# Altium schematic sheet РЕУН.468332.001_MCU.SchDoc: Плата
size 594 x 420 mm; ApprovedBy: Шавликов; CheckedBy: Шавликов; DrawnBy: Подлесный; SheetNumber: 1; SheetTotal: 6; Вид изделия: Документация; Раздел: Документация; Код документа: Э3; Вид документа: Схема электрическая принципиальная; Класс документа: Конструкторский документ; Создавать изделие в PLM: Yes; DocumentCode: РЕУН.468332.001 Э3 2D; DocumentView: Схема электрическая принципиальная; DocumentClass: Конструкторский документ; ProductView: Документация; DocName: Плата; Title_2: термостабилизации; Format: A2; DocumentType: Схема электрическая принципиальная; ImagePath: РЕУН.468332.001 Э3 ТЭ
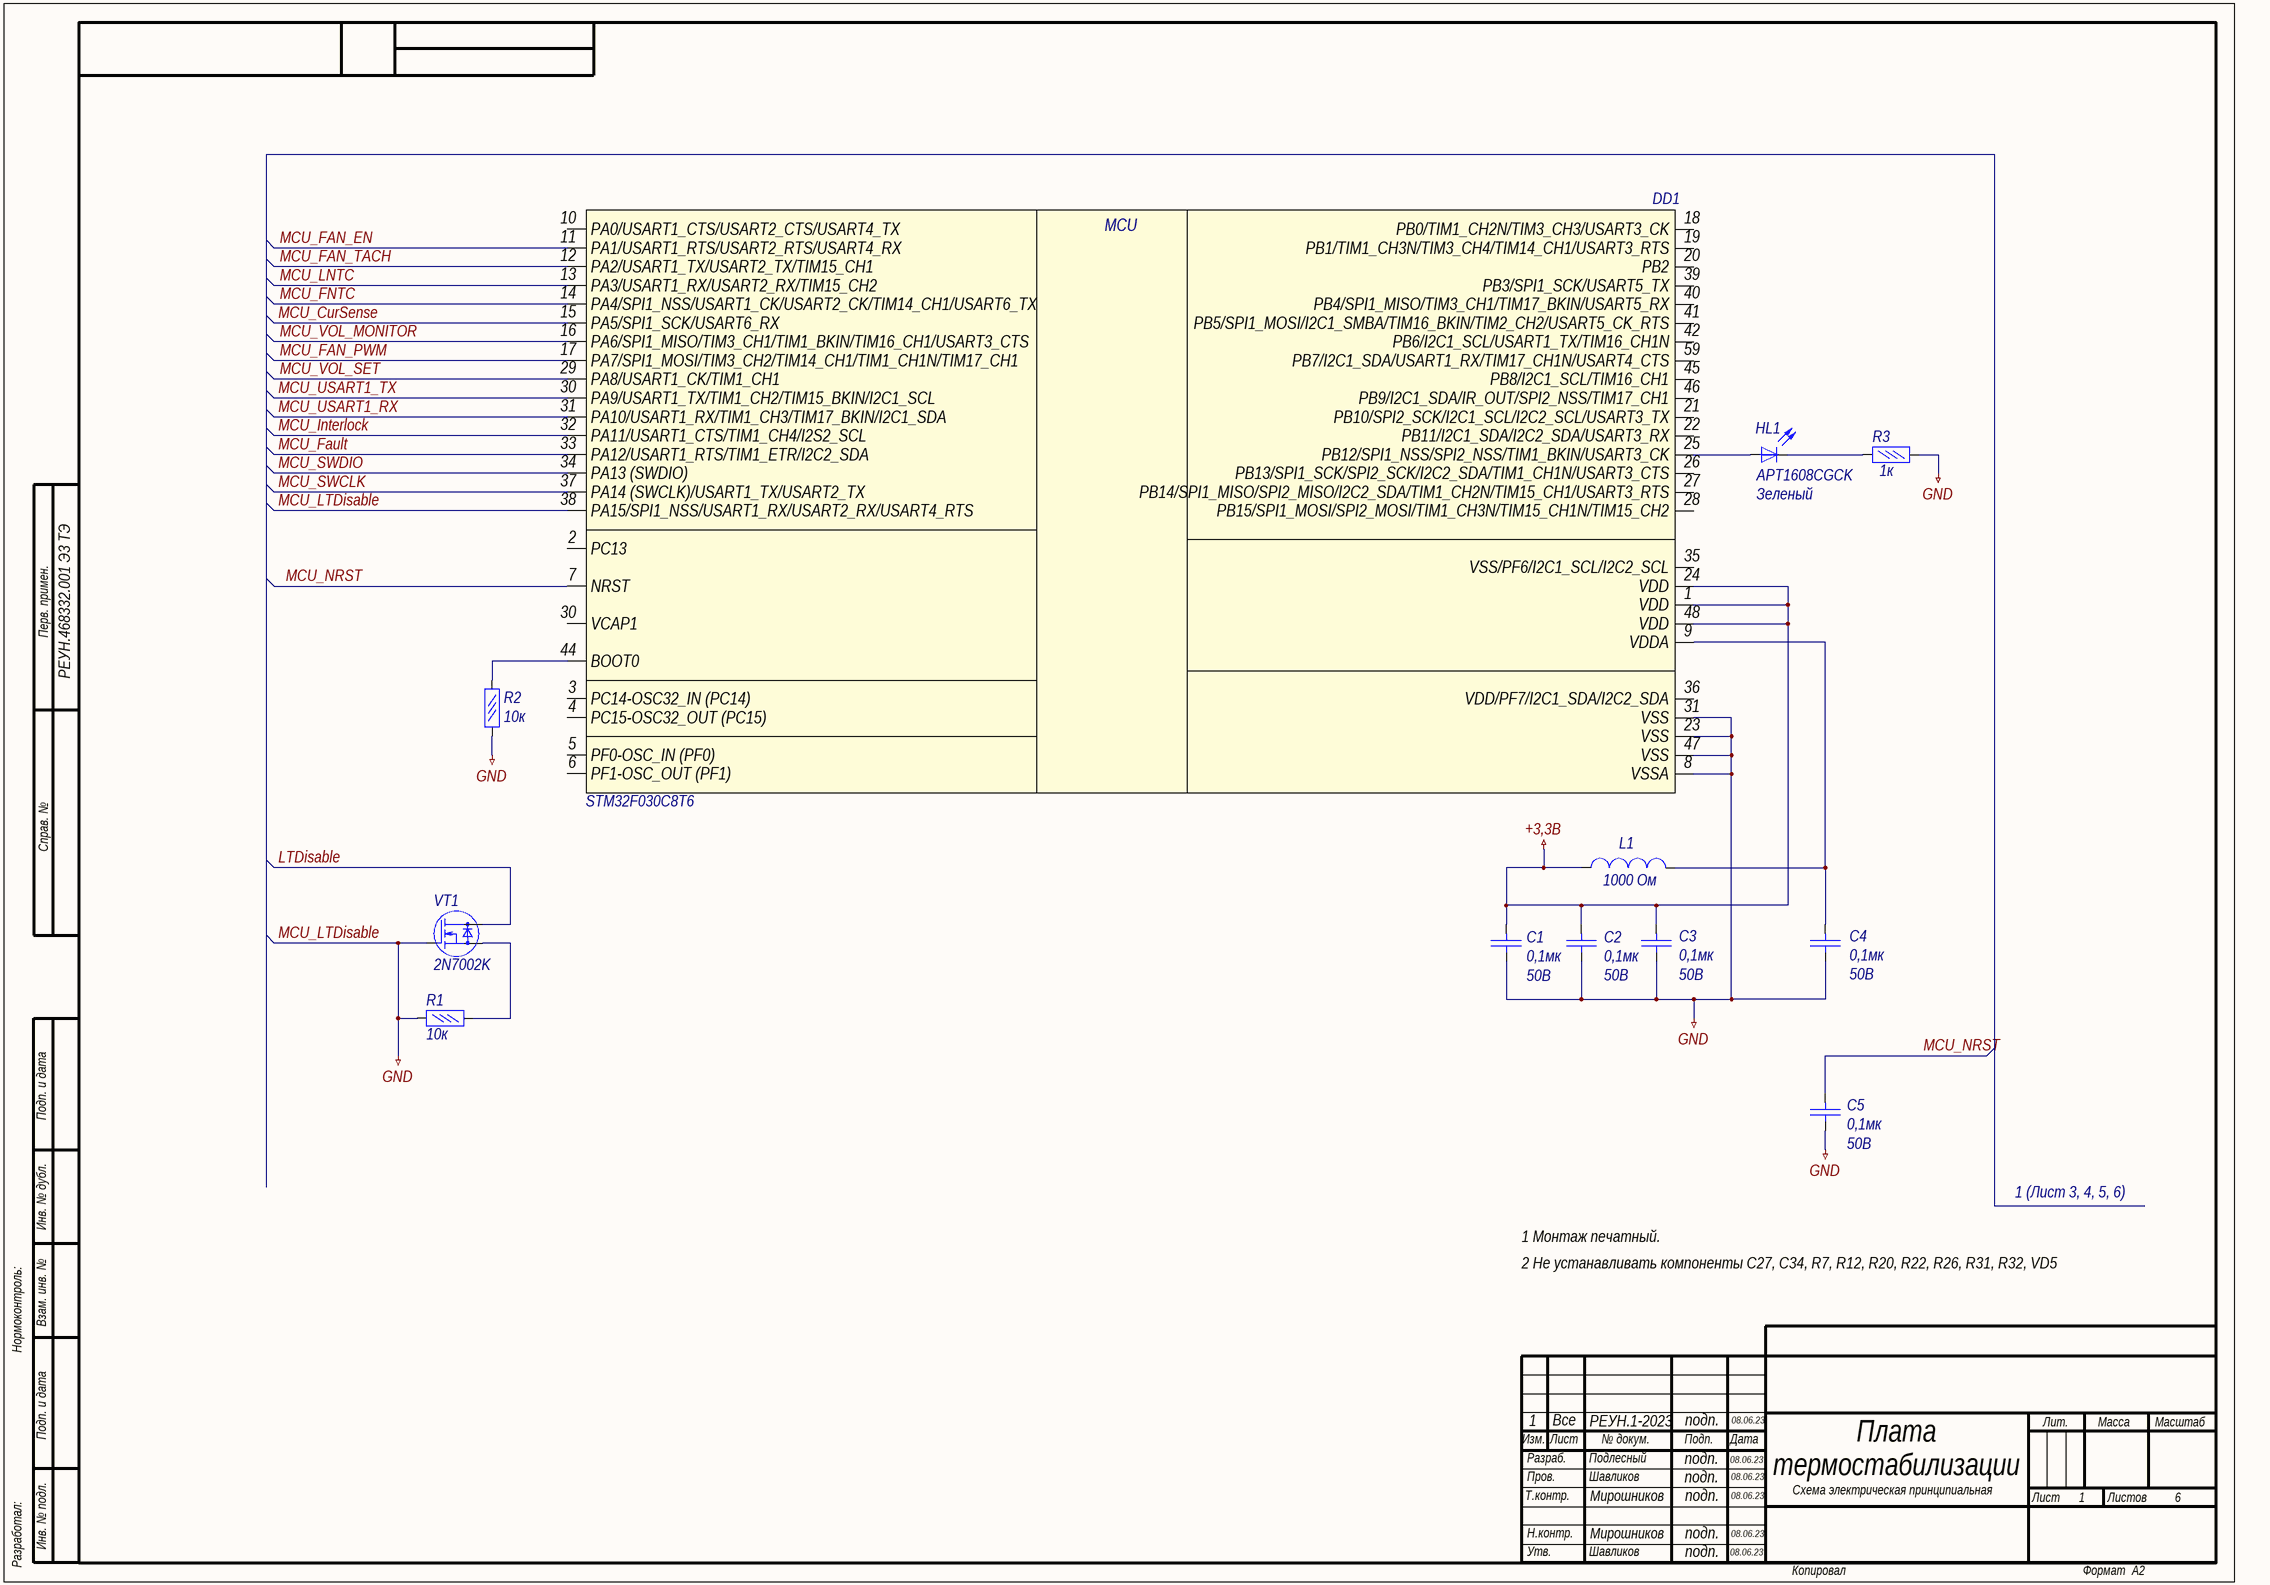
[diagram p0: РЕУН.468332.001_MCU.SchDoc]

## Parts
C1  Voltage: 50В  [C0805_AA]  (hidden comment: 0,1мк)
C2  Voltage: 50В  [C0805_AA]  (hidden comment: 0,1мк)
C3  Voltage: 50В  [C0805_AA]  (hidden comment: 0,1мк)
C4  Voltage: 50В  [C0805_AA]  (hidden comment: 0,1мк)
C5  Voltage: 50В  [C0805_AA]  (hidden comment: 0,1мк)
DD1  STM32F030C8T6
HL1  Color: Зеленый  (hidden comment: APT1608CGCK)
L1  1000 Ом  [L0603_A]
R1  10к  [R1206]
R2  10к  [R1206]
R3  1к  [R1206]
VT1  2N7002K  [SOT23-3]

## Nets
+3,3В: C1.2 C2.2 C3.2 DD1.1(VDD) DD1.24(VDD) DD1.48(VDD) L1.1
MCU_LTDisable: C1.1 C2.1 C3.1 C4.1 C5.1 DD1.8(VSSA) DD1.23(VSS) DD1.31(VSS) DD1.38(PA15/SPI1_NSS/USART1_RX/USART2_RX/USART4_RTS) DD1.47(VSS) R1.2 R2.1 R3.1 VT1.1(G)  [also labelled GND]
LTDisable: VT1.3(D)
MCU_CurSense: DD1.15(PA5/SPI1_SCK/USART6_RX)
MCU_FAN_EN: DD1.11(PA1/USART1_RTS/USART2_RTS/USART4_RX)
MCU_FAN_PWM: DD1.17(PA7/SPI1_MOSI/TIM3_CH2/TIM14_CH1/TIM1_CH1N/TIM17_CH1)
MCU_FAN_TACH: DD1.12(PA2/USART1_TX/USART2_TX/TIM15_CH1)
MCU_Fault: DD1.33(PA12/USART1_RTS/TIM1_ETR/I2C2_SDA)
MCU_FNTC: DD1.14(PA4/SPI1_NSS/USART1_CK/USART2_CK/TIM14_CH1/USART6_TX)
MCU_Interlock: DD1.32(PA11/USART1_CTS/TIM1_CH4/I2S2_SCL)
MCU_LNTC: DD1.13(PA3/USART1_RX/USART2_RX/TIM15_CH2)
MCU_NRST: C5.2 DD1.7(NRST)
MCU_SWCLK: DD1.37(PA14_(SWCLK)/USART1_TX/USART2_TX)
MCU_SWDIO: DD1.34(PA13_(SWDIO))
MCU_USART1_RX: DD1.31(PA10/USART1_RX/TIM1_CH3/TIM17_BKIN/I2C1_SDA)
MCU_USART1_TX: DD1.30(PA9/USART1_TX/TIM1_CH2/TIM15_BKIN/I2C1_SCL)
MCU_VOL_MONITOR: DD1.16(PA6/SPI1_MISO/TIM3_CH1/TIM1_BKIN/TIM16_CH1/USART3_CTS)
MCU_VOL_SET: DD1.29(PA8/USART1_CK/TIM1_CH1)
NetC4_2: C4.2 DD1.9(VDDA) L1.2
NetDD1_25: DD1.25(PB12/SPI1_NSS/SPI2_NSS/TIM1_BKIN/USART3_CK) HL1.1(A)
NetDD1_44: DD1.44(BOOT0) R2.2
NetHL1_2: HL1.2(K) R3.2
NetR1_1: R1.1 VT1.2(S)

Not connected (* = marked no-connect by the designer): DD1 2(PC13) 3(PC14-OSC32_IN_(PC14)) 4(PC15-OSC32_OUT_(PC15)) 5(PF0-OSC_IN_(PF0)) 6(PF1-OSC_OUT_(PF1)) 10(PA0/USART1_CTS/USART2_CTS/USART4_TX) 18(PB0/TIM1_CH2N/TIM3_CH3/USART3_CK) 19(PB1/TIM1_CH3N/TIM3_CH4/TIM14_CH1/USART3_RTS) 20(PB2) 21(PB10/SPI2_SCK/I2C1_SCL/I2C2_SCL/USART3_TX) 22(PB11/I2C1_SDA/I2C2_SDA/USART3_RX) 26(PB13/SPI1_SCK/SPI2_SCK/I2C2_SDA/TIM1_CH1N/USART3_CTS) 27(PB14/SPI1_MISO/SPI2_MISO/I2C2_SDA/TIM1_CH2N/TIM15_CH1/USART3_RTS) 28(PB15/SPI1_MOSI/SPI2_MOSI/TIM1_CH3N/TIM15_CH1N/TIM15_CH2) 35(VSS/PF6/I2C1_SCL/I2C2_SCL) 36(VDD/PF7/I2C1_SDA/I2C2_SDA) 39(PB3/SPI1_SCK/USART5_TX) 40(PB4/SPI1_MISO/TIM3_CH1/TIM17_BKIN/USART5_RX) 41(PB5/SPI1_MOSI/I2C1_SMBA/TIM16_BKIN/TIM2_CH2/USART5_CK_RTS) 42(PB6/I2C1_SCL/USART1_TX/TIM16_CH1N) 45(PB8/I2C1_SCL/TIM16_CH1) 46(PB9/I2C1_SDA/IR_OUT/SPI2_NSS/TIM17_CH1) 59(PB7/I2C1_SDA/USART1_RX/TIM17_CH1N/USART4_CTS)

## Notes on the sheet
- 1 (Лист 3, 4, 5, 6)
- 1 Монтаж печатный.
- 2 Не устанавливать компоненты C27, С34, R7, R12, R20, R22, R26, R31, R32, VD5
- 1
- Все
- РЕУН.1-2023
- подп.
- 08.06.23
- Мирошников
- Перв. примен.
- Справ. №
- Подп. и дата
- Инв. № дубл.
- Нормоконтроль:
- Взам. инв. №
- Изм.
- Лист
- № докум.
- Подп.
- Дата
- Лит.
- Масса
- Масштаб
- Т.контр.
- Пров.
- Разраб.
- Листов
- Разработал:
- Инв. № подл.
- Н.контр.
- Утв.
- Копировал
- Формат
- (in symbol STM32F030C8T6) MCU

## Library data of the parts
C1-C5 = Конденсатор кер.: Name: CC0603KRX7R9BB104; Value: 0,1мк
DD1 = STM32F030C8T6: 32-битный микроконтроллер; Name: STM32F030C8T6
HL1 = led: Светодиод; Name: APT1608CGCK
L1 = Inductor: Катушка индуктивности; Name: BLM18TG102TN1D; Value: 1000 Ом
R1-R3 = Резистор  0,05Вт: Резистор 0,05Вт; Name: RC0603FR-0710KL; Power rating: 0,05Вт
  R1 R2: Value: 10к
  R3: Value: 1к
VT1 = mosfet-n: Name: 2N7002K